# Altium schematic sheet Push_Button.SchDoc
size A4; SheetNumber: 19; SheetTotal: 20
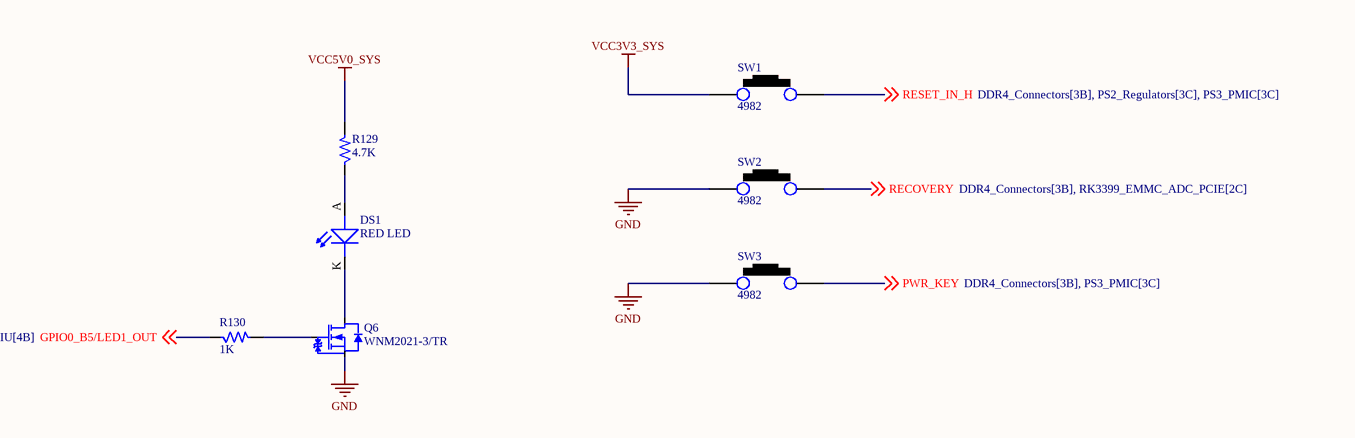
[diagram p0: Push_Button.SchDoc]

## Parts
DS1  RED LED  [LED_0805]
Q6  WNM2021-3/TR  [SOT-323-3]
R129  4.7K  [RES_0402]
R130  1K  [RES_0402]
SW1  4982  [SW_177_39.3X77.7_SMD]
SW2  4982  [SW_177_39.3X77.7_SMD]
SW3  4982  [SW_177_39.3X77.7_SMD]

## Nets
GND: Q6.2(S) SW2.1 SW3.1
VCC3V3_SYS: SW1.1
VCC5V0_SYS: R129.2
GPIO0_B5/LED1_OUT: R130.1 ; off-sheet GPIO0_B5/LED1_OUT
PWR_KEY: SW3.2 ; off-sheet PWR_KEY
RECOVERY: SW2.2 ; off-sheet RECOVERY
RESET_IN_H: SW1.2 ; off-sheet RESET_IN_H
NetDS1_A: DS1.A(ANODE) R129.1
NetDS1_K: DS1.K(CATHODE) Q6.3(D)
NetQ6_1: Q6.1(G) R130.2

## Library data of the parts
DS1 = LED_RED-2V-20mA-0805: Red 631nm LED Indication - Discrete 2V 0805 (2012 Metric); Manufacturer: Vishay Lite-On; Manufacturer Part Number: LTST-C171KRKT; Case/Package: 0805; Supplier-1: SP ROAD
Q6 = MOSFET-N_20V-820mA-SOT-323: N Channel 20V 820mA 850mV @ 250uA 310mΩ @ 550mA,4.5V 310mW SOT-323(SC-70) MOSFET RoHS; Manufacturer: WILLSEMI(Will Semicon); Manufacturer Part Number: WNM2021-3/TR; Case/Package: SOT-323(SC-70); Supplier-1: LCSC
R129 = RES_4.7K-0.1W-1%-0402: 4.7 kOhms ±1% 0.1W, 1/10W Chip Resistor 0402 (1005 Metric) Automotive AEC-Q200 Thick Film; Manufacturer: Panasonic Electronic Components; Manufacturer Part Number: ERJ-2RKF4701X; Case/Package: 0402; Supplier-1: Digikey
R130 = RES_1K-0.1W-1%-0402: 1 kOhms ±1% 0.1W, 1/10W Chip Resistor 0402 (1005 Metric) Anti-Sulfur Thin Film; Manufacturer: Vishay Beyschlag/Draloric/BC Components; Manufacturer Part Number: MCS04020C1001FE000; Case/Package: 0402; Supplier-1: Digikey
SW1-SW3 = SW1_4982: Tactile Switch 3x4x2mm SMD 2-Pin; Manufacturer: NA; Manufacturer Part Number: NA; Case/Package: SMD; Supplier-1: Sunrom